# Altium project 压控放大器.PrjPcb
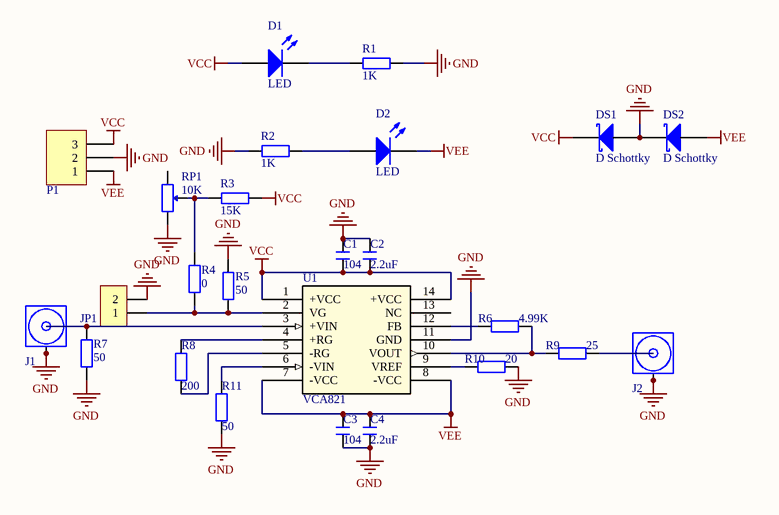
[diagram p0: 压控放大器.SchDoc]
1 sheet, 25 parts. Net scope: global (net labels, ports and power ports of the same name join across sheets).
Board file: 压控放大器.PcbDoc

## Sheet 压控放大器.SchDoc
size A4

### Parts
C1  104  [C 0603]
C2  2.2uF  [C 0603]
C3  104  [C 0603]
C4  2.2uF  [C 0603]
D1  LED  [LED_0805]
D2  LED  [LED_0805]
DS1  D Schottky  [DIODE-SMA]
DS2  D Schottky  [DIODE-SMA]
J1  COAX  [MCX5.08-5-H]  (value not drawn)
J2  COAX  [MCX5.08-5-H]  (value not drawn)
JP1  HDR-1X2  [HDR-1X2]  (value not drawn)
P1  Header 3  [HDR3X1_B2]  (value not drawn)
R1  1K  [R 0805]
R2  1K  [R 0805]
R3  15K  [R 0603]
R4  0  [R 0603]
R5  50  [R 0603]
R6  4.99K  [R 0603]
R7  50  [R 0603]
R8  200  [R 0603]
R9  25  [R 0603]
R10  20  [R 0603]
R11  50  [R 0603]
RP1  10K  [3296W]
U1  VCA821  [SOIC14_N]

### Nets
GND: C1.2 C2.2 C3.2 C4.1 DS1.1 DS2.2 J1.2(GND) J1.3(GND) J1.4(GND) J1.5(GND) J2.2(GND) J2.3(GND) J2.4(GND) J2.5(GND) JP1.2 P1.2 R1.2 R2.1 R5.1 R7.1 R10.2 R11.1 RP1.3 U1.11(GND)
VCC: C1.1 C2.1 D1.1(A) DS1.2 P1.3 R3.2 U1.1(+VCC) U1.14(+VCC)
VEE: C3.1 C4.2 D2.2(K) DS2.1 P1.1 U1.7(-VCC) U1.8(-VCC)
NetD1_2: D1.2(K) R1.1
NetD2_1: D2.1(A) R2.2
NetJ1_1: J1.1(Signal) R7.2 U1.3(+VIN)
NetJ2_1: J2.1(Signal) R9.2
NetJP1_1: JP1.1 R4.1 R5.2 U1.2(VG)
NetR3_1: R3.1 R4.2 RP1.2
NetR6_1: R6.1 U1.12(FB)
NetR6_2: R6.2 R9.1 U1.10(VOUT)
NetR8_1: R8.1 U1.5(-RG)
NetR8_2: R8.2 U1.4(+RG)
NetR10_1: R10.1 U1.9(VREF)
NetR11_2: R11.2 U1.6(-VIN)

Not connected (* = marked no-connect by the designer): RP1 1; U1 13(NC)

### Library data of the parts
C1-C4 = C: 无极性贴片电容; 版权归属: 源创客; BOM名称: 无极性贴片电容; 学习资源: www.ooocke.com
D1 D2 = LED: 发光二极管; Published: 8-Jun-2000; LatestRevisionDate: 08-Jul-2005; LatestRevisionNote: Mech Layer 1 removed.; PackageReference: LED; Publisher: Altium Limited
DS1 DS2 = D Schottky: Schottky Diode; Published: 8-Jun-2000; LatestRevisionDate: 17-Jul-2002; LatestRevisionNote: Re-released for DXP Platform.; PackageReference: SMB; Publisher: Altium Limited; PackageDescription: DO-214-AA/SMB; 2 C-Bend Leads; Body 5.3 x 3.6 mm, inc. leads (LxW); Code_JEDEC: DO-214-AA
JP1 = Header 2: 2P接插件; 版权归属: 源创客; BOM名称: 2P接插件; 学习资源: www.ooocke.com
P1 = Header 3: 接插件; LatestRevisionDate: 17-Jul-2002; LatestRevisionNote: Re-released for DXP Platform.; Publisher: Altium Limited
R1-R11 = R: 贴片电阻; 版权归属: 源创客; BOM名称: 贴片电阻; 学习资源: www.ooocke.com
RP1 = RP-ID: 插件单联电位器; BOM名称: 插件电位器; 版权归属: 源创客; 学习资源: www.ooocke.com
U1 = VCA821: 可变增益放大器 Ultra-Wideband, > 40-dB Gain Adjust Range, Linear in dB; Manufacturer: Texas Instruments; Manufacturer_Part_Number: vca821_d_14; INDUSTRY_STD_PKG_TYPE: SOIC; FAMILY_NAME: VARIABLE GAIN AMPLIFIER; PIN_COUNT: 14; PACKAGE_DESIGNATOR: D; Datasheet URL: http://www.ti.com/lit/gpn/VCA821; GENERIC_PART_NUMBER: VCA821; Vendor: Texas Instruments; RefDes: RefDes; Type: DEV; Value: Value